# EAGLE design aaduino-v2 (EAGLE 7.5.0)
CNAME: An AA size RF Arduino clone; CREVISION: 1; DESIGNER: Johan Kanflo
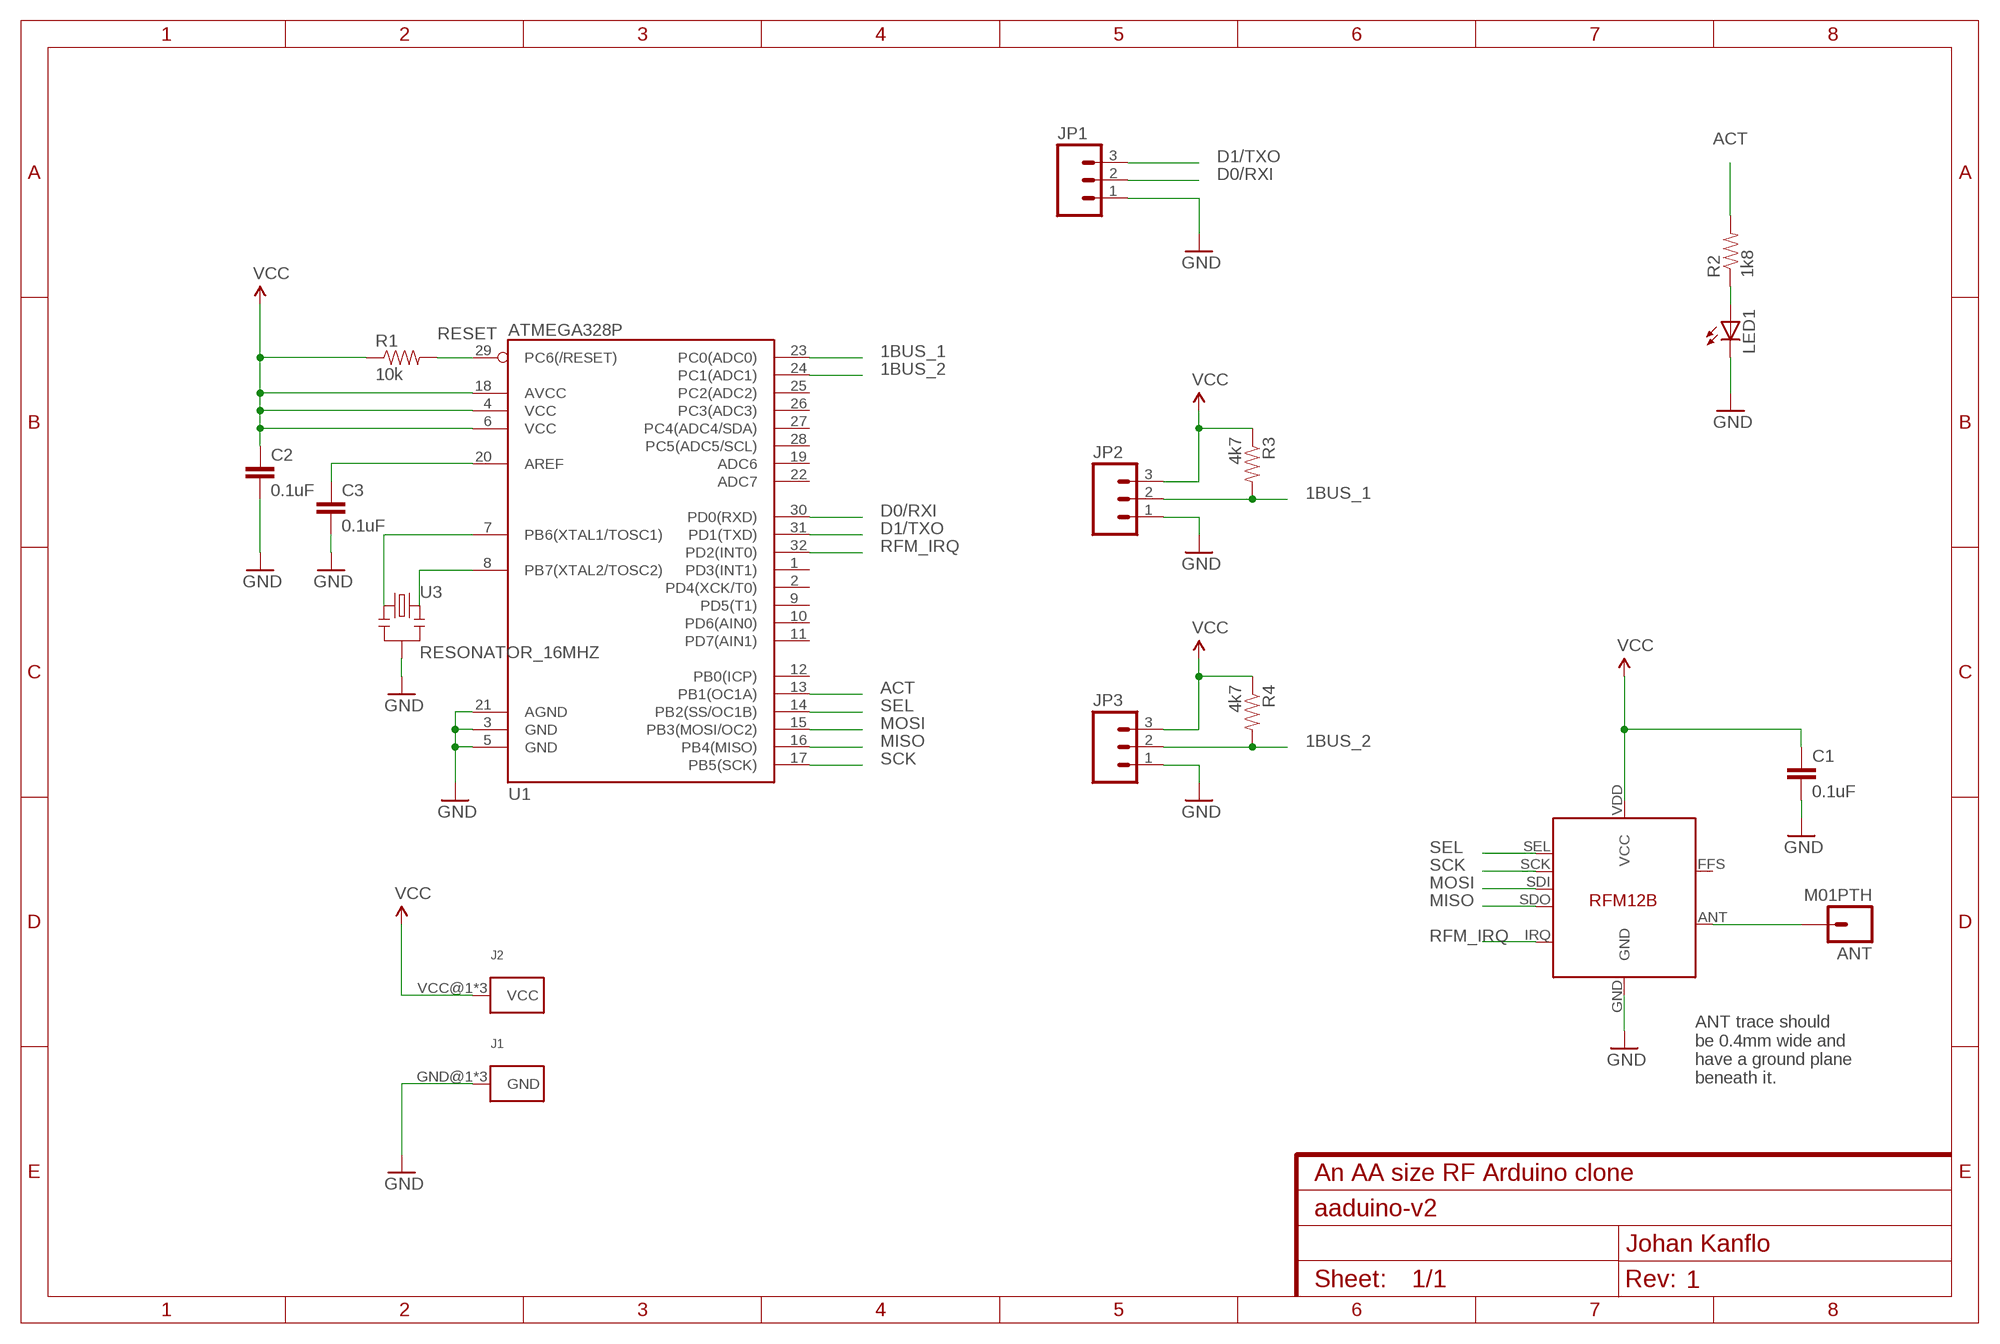
[diagram p0: schematic, sheet 1]

## Parts
ANT  M01PTH  [1X01]
C1  0.1uF  0.1UF-25V(+80/-20%)(0603)  [0603-CAP]
C2  0.1uF  0.1UF-25V(+80/-20%)(0603)  [0603-CAP]
C3  0.1uF  0.1UF-25V(+80/-20%)(0603)  [0603-CAP]
J1  KEYSTONE-629  [KEYSTONE_AA_AAA_BATTERY_TERMINAL-629]
J2  KEYSTONE-637  [KEYSTONE_AA_AAA_BATTERY_TERMINAL-637]
JP1  M03PTH  [1X03]
JP2  M03PTH  [1X03]
JP3  M03PTH  [1X03]
LED1  LED0603  [LED-0603]
R1  10k  RESISTOR0603-RES  [0603-RES]
R2  1k8  RESISTOR0603-RES  [0603-RES]
R3  4k7  RESISTOR0603-RES  [0603-RES]
R4  4k7  RESISTOR0603-RES  [0603-RES]
U1  ATMEGA328P  ATMEGA328_SMT  [TQFP32-08]
U2  RFM12B  [RFM12B]
U3  RESONATOR_16MHZ  [RESONATOR_SMD]

## Nets
1BUS_1: JP2.2 R3.2 U1.23(PC0(ADC0))
1BUS_2: JP3.2 R4.2 U1.24(PC1(ADC1))
ACT: R2.2 U1.13(PB1(OC1A))
D0/RXI: JP1.2 U1.30(PD0(RXD))
D1/TXO: JP1.3 U1.31(PD1(TXD))
GND: C1.2 C2.2 C3.2 J1.GND@1(GND) J1.GND@2(GND) J1.GND@3(GND) JP1.1 JP2.1 JP3.1 LED1.C U1.3(GND) U1.5(GND) U1.21(AGND) U2.GND U3.2
MISO: U1.16(PB4(MISO)) U2.SDO
MOSI: U1.15(PB3(MOSI/OC2)) U2.SDI
N$1: LED1.A R2.1
N$4: C3.1 U1.20(AREF)
N$5: U1.7(PB6(XTAL1/TOSC1)) U3.1
N$6: U1.8(PB7(XTAL2/TOSC2)) U3.3
N$18: ANT.1 U2.ANT
RESET: R1.2 U1.29(PC6(/RESET))
RFM_IRQ: U1.32(PD2(INT0)) U2.IRQ
SCK: U1.17(PB5(SCK)) U2.SCK
SEL: U1.14(PB2(SS/OC1B)) U2.SEL
VCC: C1.1 C2.1 J2.VCC@1(VCC) J2.VCC@2(VCC) J2.VCC@3(VCC) JP2.3 JP3.3 R1.1 R3.1 R4.1 U1.4(VCC) U1.6(VCC) U1.18(AVCC) U2.VDD(VCC)
Unconnected: U1.1(PD3(INT1)) U1.2(PD4(XCK/T0)) U1.9(PD5(T1)) U1.10(PD6(AIN0)) U1.11(PD7(AIN1)) U1.12(PB0(ICP)) U1.19(ADC6) U1.22(ADC7) U1.25(PC2(ADC2)) U1.26(PC3(ADC3)) U1.27(PC4(ADC4/SDA)) U1.28(PC5(ADC5/SCL)) U2.FFS

## Notes on the sheet
- ANT trace should
  be 0.4mm wide and
  have a ground plane
  beneath it.

## Library data of the parts
ANT = SparkFun-Connectors:M01: Header 1 Standard 1-pin 0.1" header. Use with straight break away headers (SKU : PRT-00116), right angle break away headers (PRT-00553), swiss pins (PRT-00743), machine pins (PRT-00117), and female headers (PRT-00115).
C1-C3 = SparkFun-Capacitors:0.1UF-25V(+80/-20%)(0603): CAP-00810 Ceramic Standard decoupling cap; PROD_ID: CAP-00810
J1 = kanflo:KEYSTONE-629: Keystone 629 PCB Mount Battery Contact for 1 (AA), 1 (AAA), 1 (N), Coil Spring Contact Links Data sheet <http://docs-europe.electrocomponents.com/webdocs/002e/0900766b8002ef6f.pdf> RS Online <http://se.rs-online.com/web/p/battery-holders-mounts/2050057/>
J2 = kanflo:KEYSTONE-637: Keystone 637 PCB Mount Battery Contact for 1 (AA), 1 (AAA), 1 (N), Button Contact Links Data sheet <http://docs-europe.electrocomponents.com/webdocs/13ee/0900766b813ee63e.pdf> RS Online <http://se.rs-online.com/web/p/battery-holders-mounts/3670602/>
JP1-JP3 = SparkFun-Connectors:M03: Header 3 Standard 3-pin 0.1" header. Use with straight break away headers (SKU : PRT-00116), right angle break away headers (PRT-00553), swiss pins (PRT-00743), machine pins (PRT-00117), and female headers (PRT-00115). Molex polarized connector foot print use with SKU : PRT-08232 with associated crimp pins and housings.
LED1 = SparkFun-LED:LED: LEDs Standard schematic elements and footprints for 5mm, 3mm, 1206, and 0603 sized LEDs. 5mm - Spark Fun Electronics SKU : COM-00529 (and others)
R1-R4 = SparkFun-Passives:RESISTOR: Resistor Basic schematic elements and footprints for 0603, 1206, and PTH resistors.
U1 = SparkFun-DigitalIC:ATMEGA328_SMT: 32-Pin Atmega328 part Commonly used on Arduino compatible boards Available in QFP and QFN packages TQFP is IC-09069 QFN is non-stock; PROD_ID: IC-09069
U2 = JeeParts:RFM12B
U3 = kanflo:RESONATOR_16MHZ

## Board
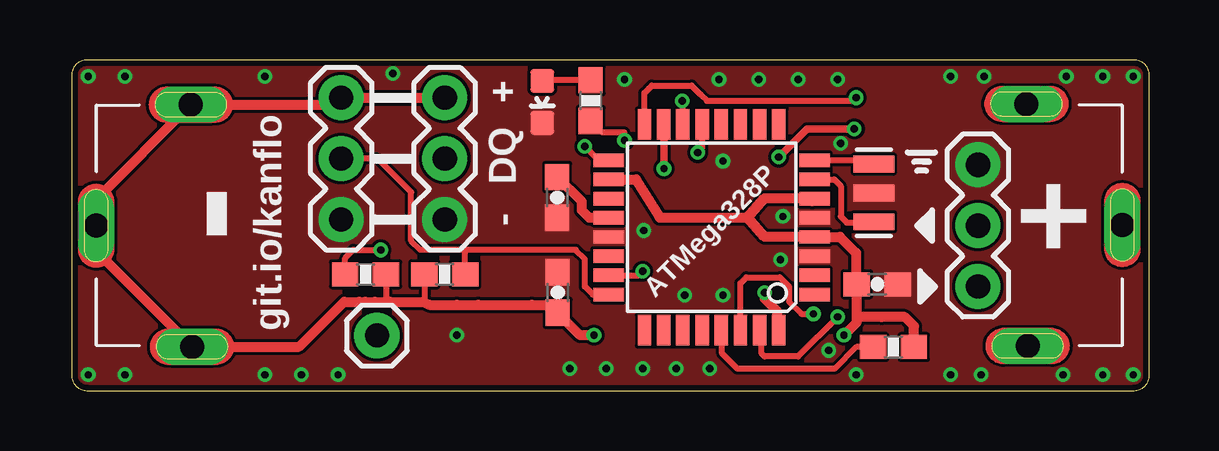
[diagram p1: board, top side]
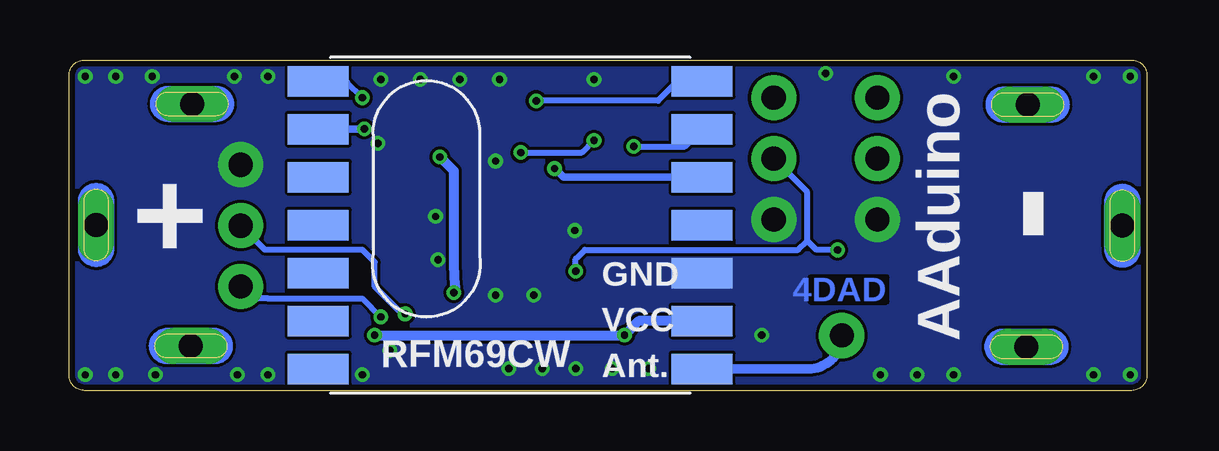
[diagram p2: board, bottom side, seen from below]

Size 44.93 x 13.79 mm. Coordinates in mm from the lower left corner, seen from the top.
Outline: 0,13.16 0,0.64 arc90 0.64,0 44.29,0 arc90 44.93,0.64 44.93,13.16 arc90 44.29,13.79 0.64,13.79 arc90 0,13.16
Copper layers (1*16): Top 0.035mm / dielectric 1.5mm / Bottom 0.035mm
Design rules "dirt_cheap_dirty_boards.v1": minimum track width 5mil, minimum drill 12mil, track to track 5mil, track to pad 5mil, pad to pad 5mil, via to via 5mil, smd to smd 0mil, copper to edge 10mil, drill to drill 10mil, minimum pad ring 10mil, minimum via ring 6mil, stop-mask expansion 2mil, vias tented up to drill 25mil, thermal gap 10mil

### Footprints (pad centres in the part's own frame; a part is rotated, then mirrored left to right if it is on the bottom)
1X01 = drill 1 pad 1.88: 1 0,0
0603-CAP = smd 1.1 x 1: 1 -0.85,0; 2 0.85,0
KEYSTONE_AA_AAA_BATTERY_TERMINAL-629 = drill 1 pad 1.5 long: GND@1 5,-0.5; GND@2 -0.05,3.45; GND@3 -5.1,-0.55
KEYSTONE_AA_AAA_BATTERY_TERMINAL-637 = drill 1 pad 1.5 long: VCC@1 5,-1.1; VCC@2 -0.05,2.85; VCC@3 -5.1,-1.15
1X03 = drill 1.016 pad 1.88: 1 0,0; 2 2.54,0; 3 5.08,0
LED-0603 = smd 1 x 1: A 0,-0.877; C 0,0.877
0603-RES = smd 1.1 x 1: 1 -0.85,0; 2 0.85,0
TQFP32-08 = smd 1.27 x 0.559: 1 -4.293,2.8; 2 -4.293,2; 3 -4.293,1.2; 4 -4.293,0.4; 5 -4.293,-0.4; 6 -4.293,-1.2; 7 -4.293,-2; 8 -4.293,-2.8; 17 4.293,-2.8; 18 4.293,-2; 19 4.293,-1.2; 20 4.293,-0.4; 21 4.293,0.4; 22 4.293,1.2; 23 4.293,2; 24 4.293,2.8 | smd 0.559 x 1.27: 9 -2.8,-4.293; 10 -2,-4.293; 11 -1.2,-4.293; 12 -0.4,-4.293; 13 0.4,-4.293; 14 1.2,-4.293; 15 2,-4.293; 16 2.8,-4.293; 25 2.8,4.293; 26 2,4.293; 27 1.2,4.293; 28 0.4,4.293; 29 -0.4,4.293; 30 -1.2,4.293; 31 -2,4.293; 32 -2.8,4.293
RFM12B = smd 2.54 x 1.27: ANT 8,-6; FFS -8,2; GND 8,-2; IRQ -8,4; P$8 -8,0; P$9 -8,-2; P$10 -8,-4; P$12 -8,-6; P$16 8,0; SCK 8,4; SDI 8,2; SDO -8,6; SEL 8,6; VDD 8,-4
RESONATOR_SMD = smd 0.7 x 1.7: 1 0.4,0.8; 2 1.6,0.8; 3 2.8,0.8

### Placement (x,y rotation side)
ANT  12.72,2.29 0 top
C1  20.27,4.09 90 top
C2  33.58,4.44 0 top
C3  20.24,8.06 270 top
J1  40.35,6.86 270 top
J2  3.87,6.93 90 top
JP1  37.78,9.42 270 top
JP2  15.55,7.14 90 top
JP3  11.24,7.14 90 top
LED1  19.62,12.04 180 top
R1  34.26,1.81 180 top
R2  21.64,12.1 270 top
R3  12.25,4.85 180 top
R4  15.55,4.85 0 top
U1  26.68,6.81 180 top
U2  26.54,6.9 0 bottom
U3  34.24,6.64 90 top

### Tracks (layer width: path | path; a pad name or v marks a point on that pad's centre or on a via)
1BUS_1  (via drill 0.3 pad 0.25)
  Top 0.254: U1.23 23.64,4.81 v23.81,4.98 | R3.2 11.4,5.53 11.74,5.87 v12.89,5.87
  Bottom 0.254: v23.81,4.98 23.81,5.49 23.68,5.61 23.43,5.87 14.54,5.87 14.16,6.25 | 14.16,6.25 14.16,8.28 JP2.2 | 14.16,6.25 13.78,5.87 v12.89,5.87
1BUS_2
  Top 0.254: 16.32,5.87 21.02,5.87 21.4,5.49 21.4,4.34 21.73,4.01 U1.24 | 16.32,5.87 14.54,5.87 14.16,6.25 14.16,8.28 12.76,9.68 JP3.2 | R4.2 16.4,5.78 16.32,5.87
ACT  (via drill 0.3 pad 0.25)
  Top 0.254: U1.13 26.28,10.12 v26.1,9.93 | v23.05,10.44 23.05,10.47 23.05,10.76 22.12,10.76 R2.2
  Bottom 0.254: v26.1,9.93 23.56,9.93 v23.05,10.44
D0/RXI  (via drill 0.3 pad 0.25)
  Top 0.254: 27.87,2.52 U1.30 27.88,4.48 28.13,4.72 29.52,4.72 29.91,4.34 29.91,3.71 30.41,3.2 v30.92,3.2
  Bottom 0.254: v30.92,3.2 31.05,3.2 32.19,4.34 32.19,5.36 32.57,5.74 32.7,5.87 36.13,5.87 36.76,5.87 JP1.2
D1/TXO  (via drill 0.3 pad 0.25)
  Top 0.254: 28.64,2.56 U1.31 28.76,2.43 28.76,1.55 28.89,1.42 30.29,1.42 v31.94,3.07
  Bottom 0.254: v31.94,3.07 32.7,3.84 36.64,3.84 37.27,3.84 JP1.3
GND  (via drill 0.3 pad 0.25)
  Top 0.406: 31.03,7.26 U1.5
  other vias: 27.15,9.58 0.7,13.11 2.22,13.11 8.06,13.11 0.7,0.66 2.22,0.66 8.06,0.66 9.59,0.66 20.76,0.91 22.29,0.91 23.81,0.91 25.21,0.91 26.6,0.91 32.7,0.66 13.4,13.23 16.06,2.31 11.11,0.66 36.64,0.66 37.91,0.66 41.34,0.66 42.99,0.66 44.26,0.66 23.05,12.98 26.98,12.98 28.64,12.98 30.29,12.98 31.94,12.98 38.03,13.11 36.64,13.11 41.46,13.11 42.99,13.11 44.26,13.11 31.56,1.68 32.06,10.31 29.65,7.26 29.55,5.46 27.15,3.98 25.55,3.98 23.85,6.68
  pour Bottom (rank 6, no thermals): 0,13.79 44.93,13.79 44.93,0 0,0
  pour Top (rank 6, no thermals): 0,13.79 44.93,13.79 44.93,0 0,0
MISO  (via drill 0.3 pad 0.25)
  Top 0.254: U1.16 23.88,12.42 24.06,12.6 24.19,12.73 25.84,12.73 26.22,12.34 26.48,12.09 32.57,12.09 v32.7,12.22
  Bottom 0.254: 34.37,12.73 U2.SDO 34.5,12.85 33.33,12.85 v32.7,12.22
MOSI  (via drill 0.3 pad 0.25)
  Top 0.305: v24.69,9.26 24.69,11.09 U1.15
  Bottom 0.305: U2.SDI 24.33,8.9 v24.69,9.26
N$1
  Top 0.254: R2.1 19.65,12.95 LED1.A
N$4
  Top 0.406: U1.20 21.58,7.21 21.27,7.52 21.27,7.88 C3.1
N$5
  Top 0.254: U1.7 31.79,8.81 32.06,8.53 32.06,7.26 32.32,7.01 33.41,7.01 U3.1
N$6
  Top 0.254: U1.8 32.64,9.61 32.83,9.42 33.42,9.42 U3.3
N$18
  Bottom 0.4: ANT.1 arc90 14.12,0.9 U2.ANT
RESET
  Top 0.254: R1.2 32.71,1.81 31.81,0.91 27.75,0.91 27.11,1.55 27.11,2.49 U1.29
RFM_IRQ  (via drill 0.3 pad 0.25)
  Top 0.305: v32.63,10.91 30.64,10.91 v29.47,9.74 | U1.32
  Top 0.406: v28.89,4.09 28.89,3.84 29.4,3.33 29.4,2.6 U1.32
  Bottom 0.305: U2.IRQ 32.64,10.9 v32.63,10.91
  Bottom 0.406: v29.47,9.74 28.89,9.16 28.89,5.23 28.84,4.39 28.84,4.14 v28.89,4.09
SCK  (via drill 0.3 pad 0.25)
  Top 0.254: U1.17 21.97,9.61 v21.4,10.19
  Bottom 0.254: v21.4,10.19 19.26,10.19 U2.SCK
SEL  (via drill 0.3 pad 0.25)
  Top 0.254: v25.46,12.09 25.46,11.12 U1.14
  Bottom 0.254: U2.SEL 19.57,12.9 20.38,12.09 v25.46,12.09
  Bottom 0.305: U2.SEL
VCC  (via drill 0.3 pad 0.25)
  Top 0.254: 11.91,3.67 12,3.71 | 14.96,3.62 14.92,3.58 | 12.67,3.75 12.63,3.71 | 16.1,3.62 16.06,3.58 | 16.91,3.62 16.95,3.58 | R3.1 13.1,3.75 13.27,3.71 | R4.1 14.7,3.62 14.67,3.71
  Top 0.406: 30.86,7.9 U1.6 30.96,8.03 28.89,8.03 28.18,7.22 | v32.19,2.31 32.73,2.85 32.73,3.07 | R1.1 35.11,2.69 34.73,3.07 33.78,3.07 32.73,3.07 | U1.18 23.54,8.81 24.53,7.22 28.18,7.22 | v21.78,2.31 21.2,2.31 C1.1 19.93,3.58 19.18,3.58 16.95,3.58 16.06,3.58 14.92,3.58 14.67,3.71 13.27,3.71 12.63,3.71 12.25,3.71 12,3.71 11.36,3.71 9.48,1.83 J2.VCC@3 1.02,5.83 J2.VCC@2 1.02,7.98 J2.VCC@1 10.95,11.93 JP3.3 JP2.3 | 32.73,3.07 C2.1 32.7,4.47 32.7,5.74 32.03,6.41 U1.4 28.89,6.41 28.18,7.22
  Bottom 0.406: v32.19,2.31 v21.78,2.31 21.19,2.9 U2.VDD

### Text on the board
Bottom: 4DAD
tNames: + | DQ | - | git.io/kanflo | - | + | ATMega328P
bNames: - | AAduino | + | RFM69CW